# EasyEDA Pro project ProPrj_741_2025-12-09.epro

# Schematic 741_Schematic
Board Name: Board1; Create Date: 2025-11-30; Page Name: P1; Project Name: 741; Schematic Name: 741_Schematic; Update Date: 2025-12-01; Company: 嘉立创EDA; Page Size: A4; Version: V1.0
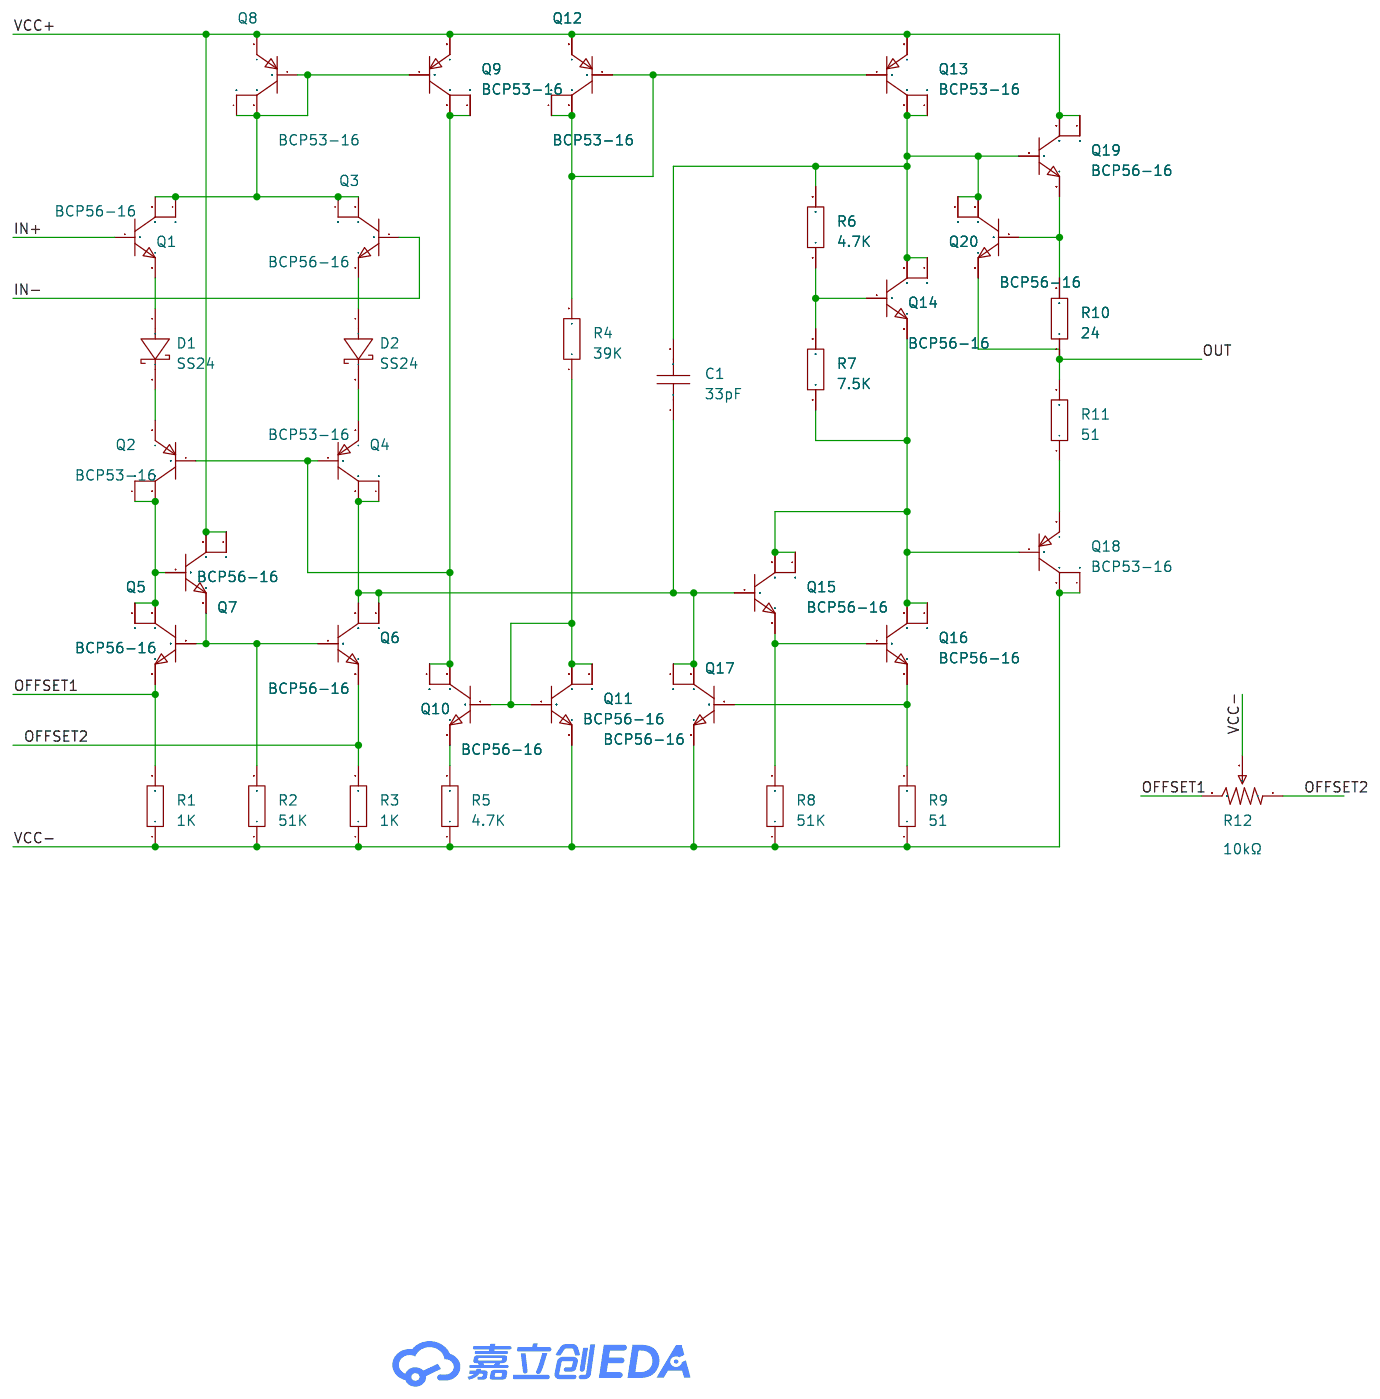
[diagram p0: schematic sheet]

## Parts
C1  33pF  [C0805]
D1  SS24  [SMA_L4.3-W2.6-LS5.0-FD]
D2  SS24  [SMA_L4.3-W2.6-LS5.0-FD]
Q1  BCP56-16  [SOT-223-4_L6.5-W3.5-P2.30-LS7.0-BR]
Q2  BCP53-16  [SOT-223-3_L6.7-W3.7-P2.30-LS7.0-BR]
Q3  BCP56-16  [SOT-223-4_L6.5-W3.5-P2.30-LS7.0-BR]
Q4  BCP53-16  [SOT-223-3_L6.7-W3.7-P2.30-LS7.0-BR]
Q5  BCP56-16  [SOT-223-4_L6.5-W3.5-P2.30-LS7.0-BR]
Q6  BCP56-16  [SOT-223-4_L6.5-W3.5-P2.30-LS7.0-BR]
Q7  BCP56-16  [SOT-223-4_L6.5-W3.5-P2.30-LS7.0-BR]
Q8  BCP53-16  [SOT-223-3_L6.7-W3.7-P2.30-LS7.0-BR]
Q9  BCP53-16  [SOT-223-3_L6.7-W3.7-P2.30-LS7.0-BR]
Q10  BCP56-16  [SOT-223-4_L6.5-W3.5-P2.30-LS7.0-BR]
Q11  BCP56-16  [SOT-223-4_L6.5-W3.5-P2.30-LS7.0-BR]
Q12  BCP53-16  [SOT-223-3_L6.7-W3.7-P2.30-LS7.0-BR]
Q13  BCP53-16  [SOT-223-3_L6.7-W3.7-P2.30-LS7.0-BR]
Q14  BCP56-16  [SOT-223-4_L6.5-W3.5-P2.30-LS7.0-BR]
Q15  BCP56-16  [SOT-223-4_L6.5-W3.5-P2.30-LS7.0-BR]
Q16  BCP56-16  [SOT-223-4_L6.5-W3.5-P2.30-LS7.0-BR]
Q17  BCP56-16  [SOT-223-4_L6.5-W3.5-P2.30-LS7.0-BR]
Q18  BCP53-16  [SOT-223-3_L6.7-W3.7-P2.30-LS7.0-BR]
Q19  BCP56-16  [SOT-223-4_L6.5-W3.5-P2.30-LS7.0-BR]
Q20  BCP56-16  [SOT-223-4_L6.5-W3.5-P2.30-LS7.0-BR]
R1  1K  [R0805]
R2  51K  [R0805]
R3  1K  [R0805]
R4  39K  [R0805]
R5  4.7K  [R0805]
R6  4.7K  [R0805]
R7  7.5K  [R0805]
R8  51K  [R0805]
R9  51  [R0805]
R10  24  [R0805]
R11  51  [R0805]
R12  10kΩ  [电位器]

## Library data of the parts
C1 = CAP_0805: Supplier Footprint: 0805
D1 D2 = SS24_C7420362: 二极管配置:独立式;正向压降(Vf):550mV@2A;直流反向耐压(Vr):40V;整流电流:2A;; LCSC Part Name: 电压:40V 电流:2A; Supplier Part: C7420362; Manufacturer: R+O(宏嘉诚); Supplier Footprint: SMA(DO-214AC); JLCPCB Part Class: 扩展库; Datasheet: https://item.szlcsc.com/datasheet/SS24/8397184.html; Supplier: LCSC; Diode Configuration: 独立式; Voltage - Forward(Vf@If): 550mV@2A; Voltage - DC Reverse(Vr): 40V; Current - Rectified: 2A; Reverse Leakage Current (Ir): 200uA@40V; Operating Junction Temperature Range: -55℃~+150℃; Non-Repetitive Peak Forward Surge Current: 50A
Q1 Q3 Q5-Q7 Q10 Q11 Q14-Q17 Q19 Q20 = BCP56-16_C41375109: 晶体管类型:NPN;集电极电流(Ic):1A;集射极击穿电压(Vceo):80V;耗散功率(Pd):1.33W;直流电流增益(hFE):25@5mA,2V;; LCSC Part Name: NPN 电流:1A 电压:80V; Supplier Part: C41375109; Manufacturer: R+O(宏嘉诚); Supplier Footprint: SOT-223; JLCPCB Part Class: 扩展库; Datasheet: https://item.szlcsc.com/datasheet/BCP56-16/43142109.html; Supplier: LCSC; type: NPN; Current - Collector(Ic): 1A; Collector - Emitter Voltage VCEO: 80V; Pd - Power Dissipation: 1.33W; DC Current Gain: 25@5mA,2V; Transition frequency(fT): 130MHz; Current - Collector Cutoff: 100nA; Vce Saturation(VCE(sat)): 500mV@500mA,50mA; Emitter-Base Voltage(Vebo): 5V
Q2 Q4 Q8 Q9 Q12 Q13 Q18 = BCP53-16_C41375110: 晶体管类型:PNP;集电极电流(Ic):1A;集射极击穿电压(Vceo):100V;耗散功率(Pd):1.5W;直流电流增益(hFE):250@150mA,3V;; LCSC Part Name: PNP 电流:1A 电压:100V; Supplier Part: C41375110; Manufacturer: R+O(宏嘉诚); Supplier Footprint: SOT-223; JLCPCB Part Class: 扩展库; Datasheet: https://item.szlcsc.com/datasheet/BCP53-16/43142110.html; Supplier: LCSC; type: PNP; Current - Collector(Ic): 1A; Collector - Emitter Voltage VCEO: 100V; Pd - Power Dissipation: 1.5W; DC Current Gain: 250@150mA,3V; Transition frequency(fT): 100MHz; Current - Collector Cutoff: 100nA; Vce Saturation(VCE(sat)): 500mV@500mA,50mA; Emitter-Base Voltage(Vebo): 5V
R1-R11 = Res_0805: Supplier Footprint: 0805
R12 = 3296W-1-103_C48997937: 阻值:10kΩ;精度:±10%;功率:500mW;温度系数:±250ppm/℃;; LCSC Part Name: 3296W-1-103; Supplier Part: C48997937; Manufacturer: JIERR(捷而瑞); Manufacturer Part: 3296W-1-103; Supplier Footprint: 插件-3P,9.5x4.9mm; JLCPCB Part Class: 扩展库; Datasheet: https://item.szlcsc.com/datasheet/3296W-1-103/51342073.html; Supplier: LCSC; Tolerance: ±10%; Power(Watts): 500mW; Temperature Coefficient: ±250ppm/℃; Number of Turns: 28

## Nets
VCC+: Q7.2(C) Q7.4(C) Q8.3(E) Q9.3(E) Q12.3(E) Q13.3(E) Q19.2(C) Q19.4(C)
VCC-: Q11.3(E) Q17.3(E) Q18.2(C) Q18.4(C) R1.1 R2.1 R3.1 R5.1 R8.1 R9.1 R12.2
IN+: Q1.1(B)
IN-: Q3.1(B)
OFFSET1: Q5.3(E) R1.2 R12.3
OFFSET2: Q6.3(E) R3.2 R12.1
OUT: Q20.3(E) R10.1 R11.2
$1N519: Q1.2(C) Q1.4(C) Q3.2(C) Q3.4(C) Q8.1(B) Q8.2(C) Q8.4(C) Q9.1(B)
$1N1834: D1.1(A) Q1.3(E)
$1N1839: D1.2(K) Q2.3(E)
$1N1844: Q2.2(C) Q2.4(C) Q5.2(C) Q5.4(C) Q7.1(B)
$1N1895: C1.1 Q4.2(C) Q4.4(C) Q6.2(C) Q6.4(C) Q15.1(B) Q17.2(C) Q17.4(C)
$1N1914: D2.2(K) Q4.3(E)
$1N1919: D2.1(A) Q3.3(E)
$1N2205: Q10.3(E) R5.2
$1N2269: Q12.1(B) Q12.2(C) Q12.4(C) Q13.1(B) R4.2
$1N2407: Q10.1(B) Q11.1(B) Q11.2(C) Q11.4(C) R4.1
$1N2487: Q15.3(E) Q16.1(B) R8.2
$1N2501: Q16.3(E) Q17.1(B) R9.2
$1N2520: Q14.3(E) Q15.2(C) Q15.4(C) Q16.2(C) Q16.4(C) Q18.1(B) R7.1
$1N2546: C1.2 Q13.2(C) Q13.4(C) Q14.2(C) Q14.4(C) Q19.1(B) Q20.2(C) Q20.4(C) R6.2
$1N2565: Q14.1(B) R6.1 R7.2
$1N2679: Q19.3(E) Q20.1(B) R10.2
$1N2714: Q18.3(E) R11.1
$1N3714: Q2.1(B) Q4.1(B) Q9.2(C) Q9.4(C) Q10.2(C) Q10.4(C)
$1N3732: Q5.1(B) Q6.1(B) Q7.3(E) R2.2

# Board 741_PCB
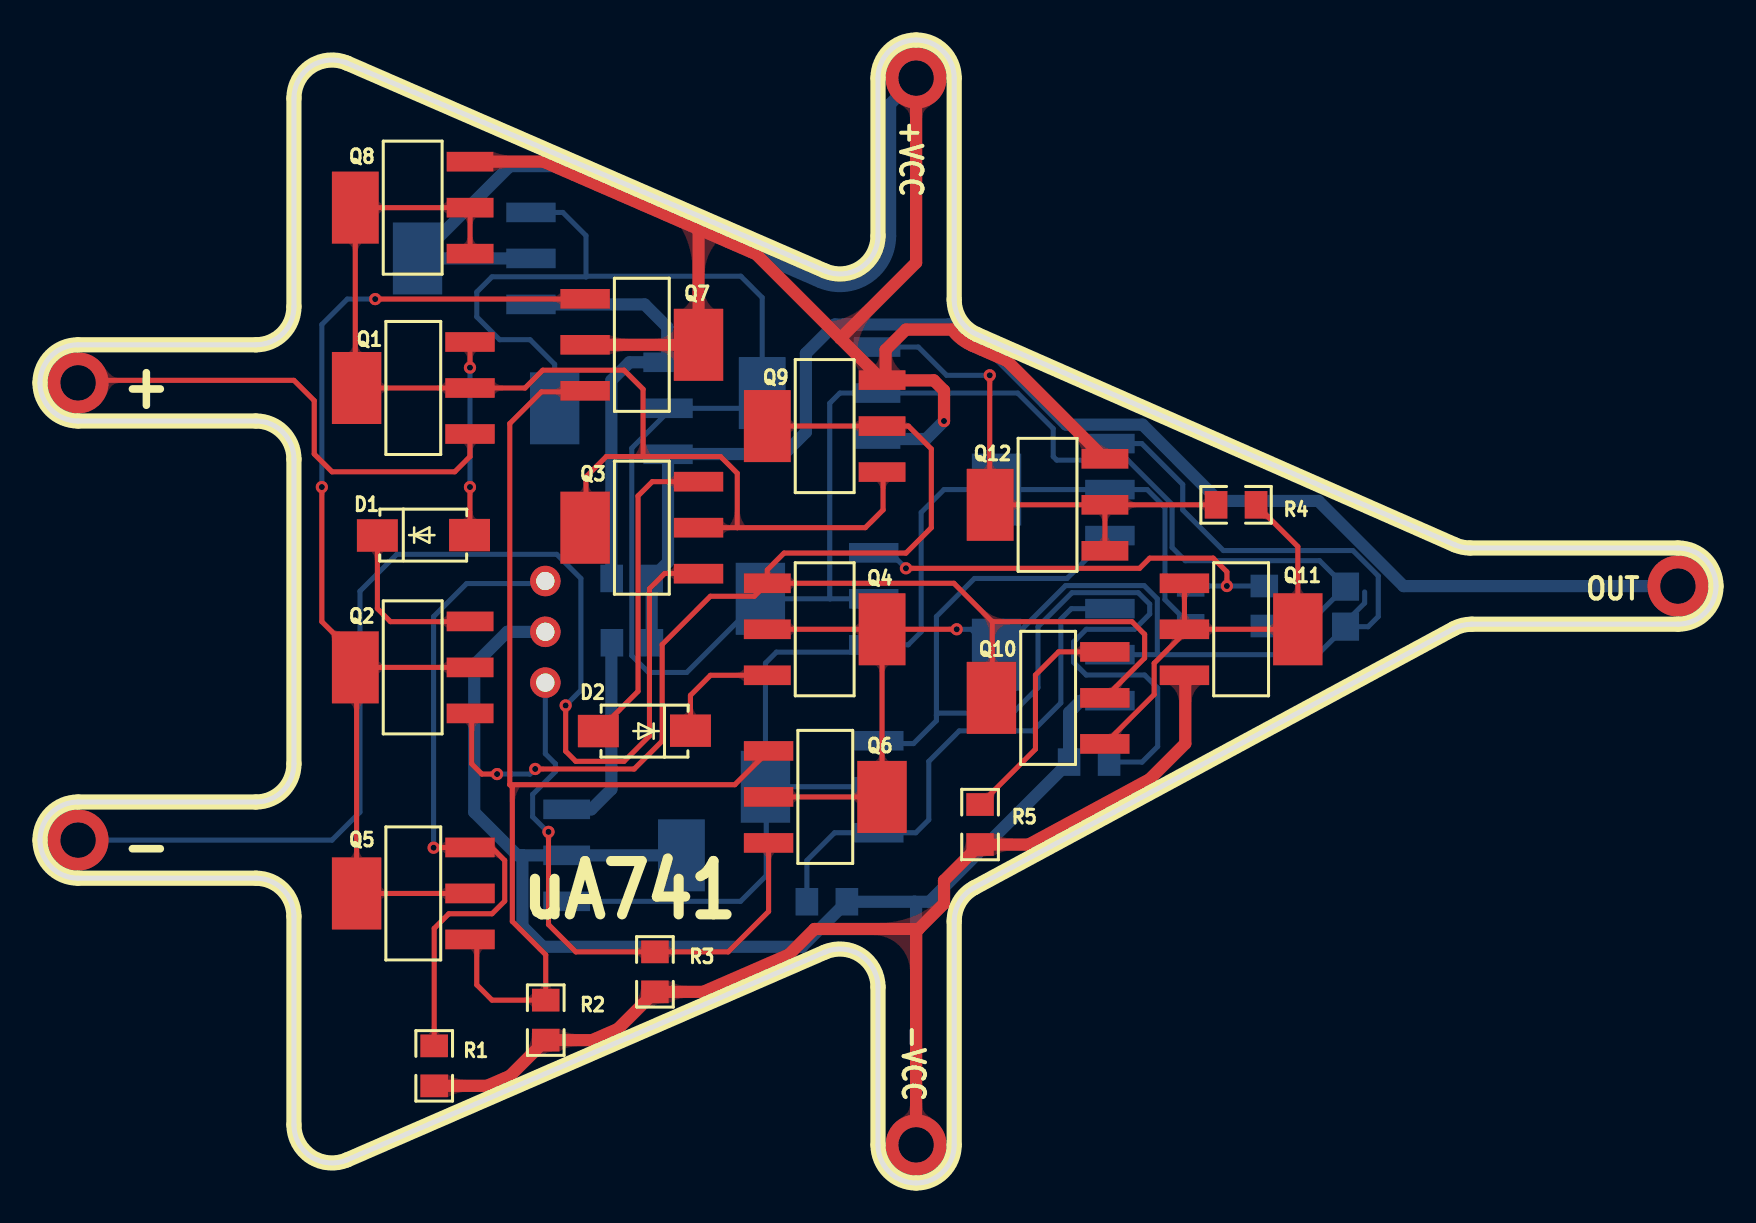
[diagram p1: board, top side]
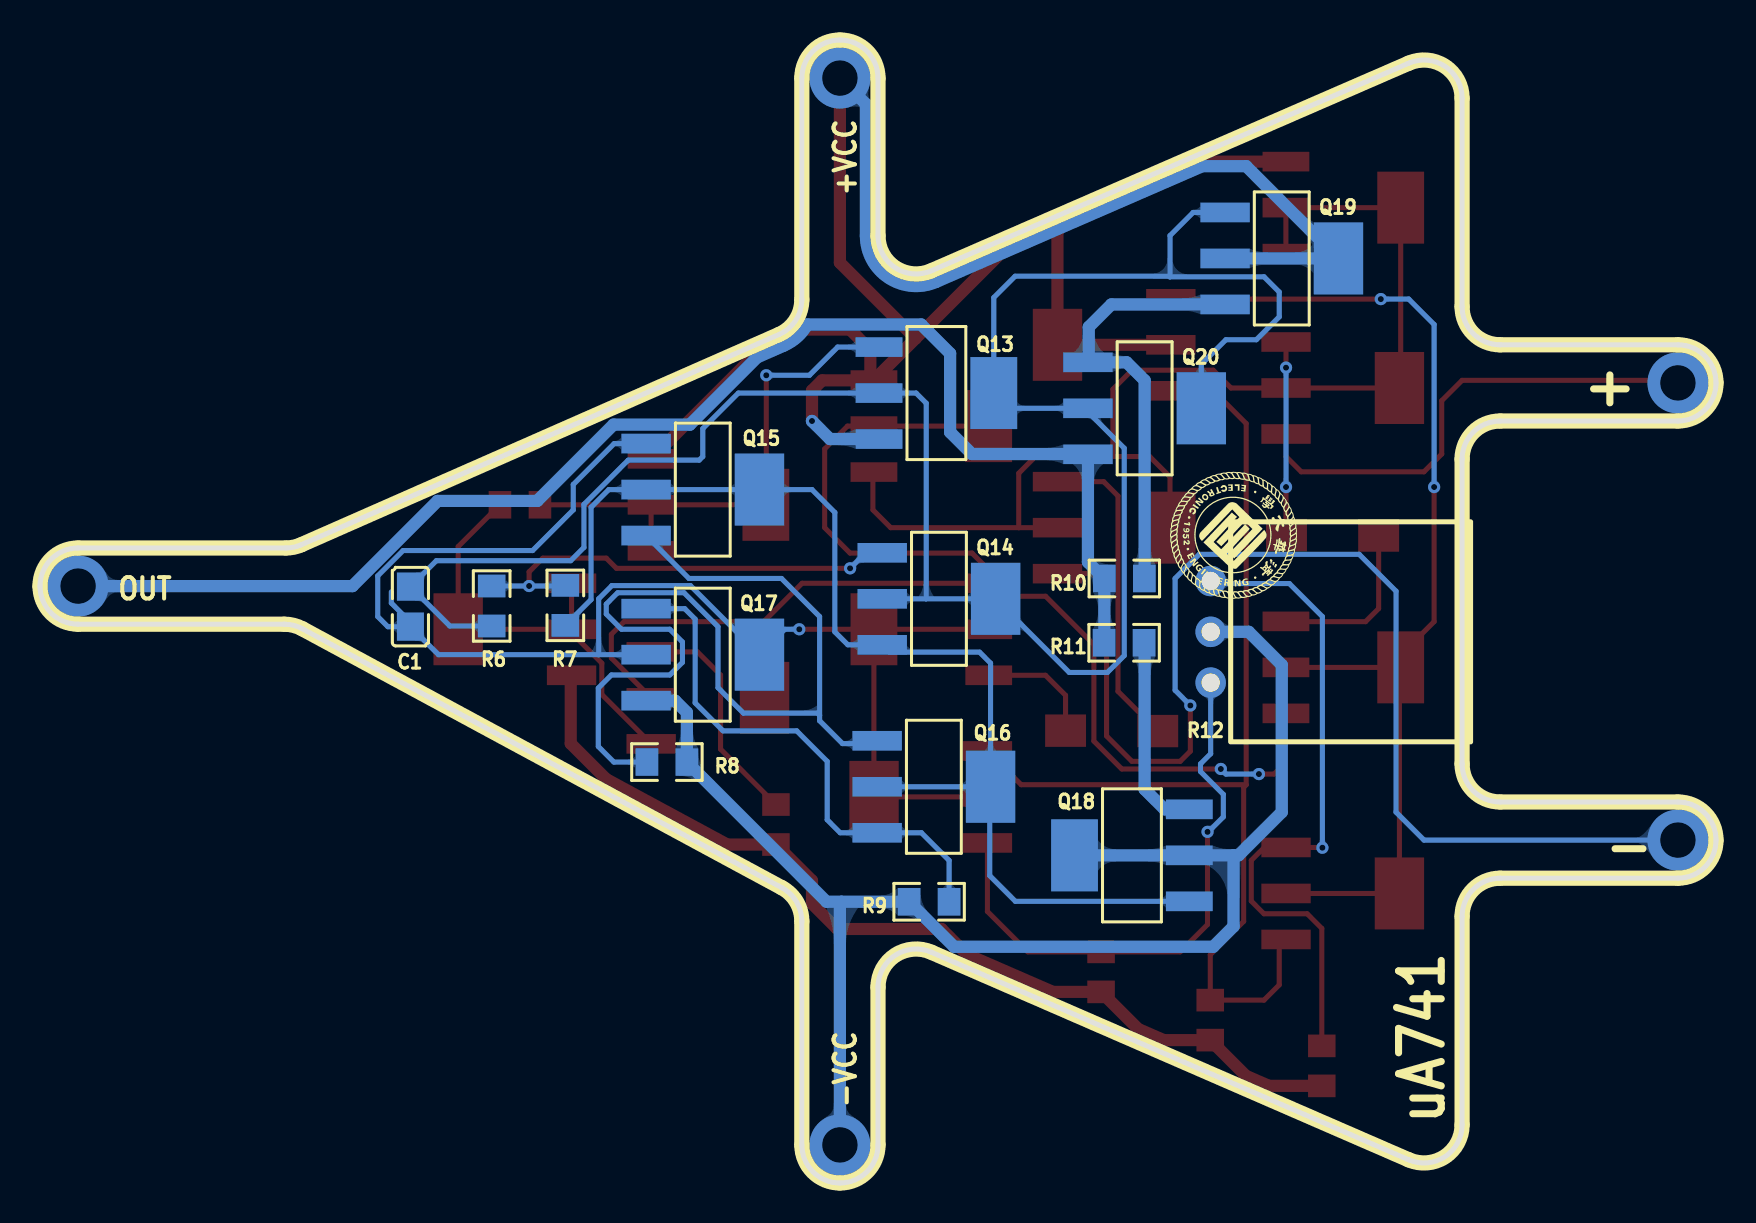
[diagram p2: board, bottom side, seen from below]

Outline 83.82 x 57.15 mm; copper layers: Top Layer, Bottom Layer. Coordinates in mm from the lower left corner of the outline.
Outline path: 0,40.01 arc(0.56,41.35) 1.91,41.91 10.8,41.91 arc(12.14,42.47) 12.7,43.82 12.7,54.24 arc(13.56,55.84) 15.36,55.99 39.25,45.61 arc(41.05,45.76) 41.91,47.36 41.91,55.25 arc(42.47,56.59) 43.81,57.15 arc(45.16,56.59) 45.72,55.25 45.72,44.17 arc(46.03,43.13) 46.86,42.43 70.75,31.91 arc(71.13,31.79) 71.52,31.75 81.91,31.75 arc(83.26,31.19) 83.82,29.84 arc(83.26,28.5) 81.91,27.94 71.6,27.94 arc(71.13,27.88) 70.7,27.71 46.72,14.76 arc(45.99,14.06) 45.72,13.09 45.72,1.91 arc(45.16,0.56) 43.81,0 arc(42.47,0.56) 41.91,1.91 41.91,9.79 arc(41.05,11.39) 39.25,11.54 15.36,1.16 arc(13.56,1.31) 12.7,2.91 12.7,13.34 arc(12.14,14.68) 10.8,15.24 1.91,15.24 arc(0.56,15.8) 0,17.15 arc(0.56,18.49) 1.91,19.05 10.8,19.05 arc(12.14,19.61) 12.7,20.96 12.7,36.2 arc(12.14,37.54) 10.8,38.1 1.91,38.1 arc(0.56,38.66) 0,40.01
Stack: Top Layer 0.035mm / Dielectric1 1.51mm FR4 er 4.5 / Bottom Layer 0.035mm

## Design rules (mm)
template: JLCPCB Capability(Two Layers Board)
spacing copperThickness1oz (default): track to track 0.102, other pairs 0.152 to 0.3
spacing copperThickness2oz: track to track 0.203, other pairs 0.152 to 0.3
track width copperThickness1oz (default): min 0.127, default 0.254, max 2.54
track width copperThickness2oz: min 0.203, default 0.254, max 2.54
differential pair differentialPair (default): width min 0.127, default 0.254, max 2.54; gap min 0.152, default 0.152
via viaSize (default): diameter min 0.5, default 0.61, max 10; hole min 0.3, default 0.305, max 6.3

## Placement (name value [footprint] x y rotation side)
C1  33pF  [C0805]  65.29 28.82 90 bottom
D1  SS24  [SMA_L4.3-W2.6-LS5.0-FD]  19.18 32.39 180 top
D2  SS24  [SMA_L4.3-W2.6-LS5.0-FD]  30.23 22.61 0 top
Q1  BCP56-16  [SOT-223-4_L6.5-W3.5-P2.30-LS7.0-BR]  18.67 39.75 0 top
Q2  BCP53-16  [SOT-223-3_L6.7-W3.7-P2.30-LS7.0-BR]  18.64 25.78 0 top
Q3  BCP56-16  [SOT-223-4_L6.5-W3.5-P2.30-LS7.0-BR]  30.1 32.77 0 top
Q4  BCP53-16  [SOT-223-3_L6.7-W3.7-P2.30-LS7.0-BR]  39.24 27.69 180 top
Q5  BCP56-16  [SOT-223-4_L6.5-W3.5-P2.30-LS7.0-BR]  18.67 14.48 0 top
Q6  BCP56-16  [SOT-223-4_L6.5-W3.5-P2.30-LS7.0-BR]  39.27 19.3 180 top
Q7  BCP56-16  [SOT-223-4_L6.5-W3.5-P2.30-LS7.0-BR]  30.1 41.91 180 top
Q8  BCP53-16  [SOT-223-3_L6.7-W3.7-P2.30-LS7.0-BR]  18.64 48.77 0 top
Q9  BCP53-16  [SOT-223-3_L6.7-W3.7-P2.30-LS7.0-BR]  39.24 37.85 0 top
Q10  BCP56-16  [SOT-223-4_L6.5-W3.5-P2.30-LS7.0-BR]  50.42 24.26 0 top
Q11  BCP56-16  [SOT-223-4_L6.5-W3.5-P2.30-LS7.0-BR]  60.07 27.69 180 top
Q12  BCP53-16  [SOT-223-3_L6.7-W3.7-P2.30-LS7.0-BR]  50.39 33.91 0 top
Q13  BCP53-16  [SOT-223-3_L6.7-W3.7-P2.30-LS7.0-BR]  38.99 39.5 0 bottom
Q14  BCP56-16  [SOT-223-4_L6.5-W3.5-P2.30-LS7.0-BR]  38.86 29.21 0 bottom
Q15  BCP56-16  [SOT-223-4_L6.5-W3.5-P2.30-LS7.0-BR]  50.67 34.67 0 bottom
Q16  BCP56-16  [SOT-223-4_L6.5-W3.5-P2.30-LS7.0-BR]  39.12 19.81 0 bottom
Q17  BCP56-16  [SOT-223-4_L6.5-W3.5-P2.30-LS7.0-BR]  50.67 26.42 0 bottom
Q18  BCP53-16  [SOT-223-3_L6.7-W3.7-P2.30-LS7.0-BR]  29.21 16.38 180 bottom
Q19  BCP56-16  [SOT-223-4_L6.5-W3.5-P2.30-LS7.0-BR]  21.72 46.23 0 bottom
Q20  BCP56-16  [SOT-223-4_L6.5-W3.5-P2.30-LS7.0-BR]  28.57 38.73 0 bottom
R1  1K  [R0805]  19.72 5.86 90 top
R2  51K  [R0805]  25.29 8.14 90 top
R3  1K  [R0805]  30.75 10.56 90 top
R4  39K  [R0805]  59.82 33.91 180 top
R5  4.7K  [R0805]  47.01 17.92 90 top
R6  4.7K  [R0805]  61.23 28.85 270 bottom
R7  7.5K  [R0805]  57.55 28.88 90 bottom
R8  51K  [R0805]  52.47 21.05 0 bottom
R9  51  [R0805]  39.35 14.06 180 bottom
R10  24  [R0805]  29.59 30.23 180 bottom
R11  51  [R0805]  29.6 27.01 0 bottom
R12  10kΩ  [电位器]  25.27 25.02 90 bottom

## Footprints (pads in the part's own frame, mm; a bottom-side part is the same pattern mirrored in y, then rotated)
C0805
  rect 1.41x1.35 smd: 1(-1,0) 2(1,0)
R0805
  rect 1.133x1.377 smd: 1(-1,0) 2(1,0)
SMA_L4.3-W2.6-LS5.0-FD
  rect 2.046x1.62 smd: 1(-2.304,-0.009) 2(2.304,0.009)
SOT-223-3_L6.7-W3.7-P2.30-LS7.0-BR
  rect 2.34x0.98 smd: 1(2.87,-2.3) 2(2.87,0) 3(2.87,2.3)
  rect 2.34x3.6 smd: 4(-2.87,0)
SOT-223-4_L6.5-W3.5-P2.30-LS7.0-BR
  rect 2.47x0.98 smd: 1(2.835,-2.3) 2(2.835,0) 3(2.835,2.3)
  rect 2.47x3.6 smd: 4(-2.835,0)
电位器
  round 1.524 hole 0.914: 1(0,0) 2(2.54,0) 3(5.08,0)

## Nets
As in the schematic.

## Via types
v1: diameter 3.048, hole 1.778, Top Layer to Bottom Layer, 5 vias
v2: diameter 0.61, hole 0.305, Top Layer to Bottom Layer, 14 vias

## Routing (per net, layer and track width the routed paths; a pad name or vN(x,y) marks a point on that pad's centre or on a via; arc(x,y) is an arc through that point)
VCC+: length 116.5
  Top Layer w0.61: 40.03,42.23 35.82,46.44 33.01,47.66 ; 40.03,42.23 43.81,46.02 v1(43.81,55.25) ; 40.03,42.23 Q9.3 ; v2(45.21,38.1) 45.21,39.62 44.7,40.13 42.13,40.13 Q9.3 ; Q7.2 Q7.4 32.93,47.58 33.01,47.66 ; Q8.3 25.17,51.07 33.01,47.66 ; Q9.3 42.29,40.32 42.29,41.66 43.31,42.67 45.61,42.67 arc(46.06,42.21) 46.61,41.87 48.37,41.1 Q12.3
  Bottom Layer w0.61: v2(45.21,38.1) 44.31,37.2 Q13.3 ; Q19.2 Q19.4 23.5,50.84 25.69,50.84 39,45.05 arc(41.38,45.26) 42.51,47.36 42.51,53.95 v1(43.81,55.25)
VCC-: length 133.4
  Top Layer w0.61: 43.94,12.7 38.74,12.7 37.46,11.42 33.16,9.56 R3.1 28.9,7.7 27.61,7.14 R2.1 23.51,5.36 22.36,4.86 R1.1 ; 43.94,12.7 43.81,12.57 v1(43.81,1.91) ; 43.94,12.7 45.21,13.97 45.21,15.12 R5.1 49.44,16.92 55.5,20.19 57.28,21.97 57.28,25.34 Q11.3
  Bottom Layer w0.61: Q18.4 Q18.2 24.13,16.38 ; 24.13,16.38 23.88,16.38 21.72,18.54 21.72,25.91 23.37,27.56 R12.2 ; 24.13,16.38 24.13,16.38 24.13,12.83 25.15,11.81 38.1,11.81 R9.1 43.74,14.06 ; Q17.3 52.06,24.12 51.47,23.53 R8.1 44.48,14.06 43.74,14.06 ; v1(43.81,1.91) 43.81,13.98 43.74,14.06
IN+: length 24.6
  Top Layer w0.254: Q1.1 21.5,36.32 20.74,35.56 14.61,35.56 13.72,36.45 13.72,39.12 12.7,40.13 2.03,40.13 v1(1.91,40.01)
IN-: length 62.1
  Top Layer w0.254: Q3.1 32.92,30.48 31.24,30.48 30.48,29.72 30.48,22.35 29.21,21.08 26.8,21.08 26.29,21.59 v2(26.29,23.88)
  Bottom Layer w0.254: v1(1.91,17.15) 14.61,17.15 16,18.54 16,29.59 17.84,31.43 25.84,31.43 27.05,30.23 27.05,24.64 v2(26.29,23.88)
OFFSET1: length 33.7
  Top Layer w0.254: v2(19.69,16.76) 19.7,16.78 Q5.3 22.59,16.78 23.24,16.13 23.24,14.1 22.61,13.46 20.45,13.46 19.72,12.73 R1.2
  Bottom Layer w0.254: v2(19.69,16.76) 19.69,28.32 21.34,29.97 25.15,29.97 R12.3
OFFSET2: length 29
  Top Layer w0.254: R3.2 26.8,11.56 25.43,12.92 v2(25.43,17.56) ; 30.75,11.56 34.42,11.56 36.44,13.58 Q6.3
  Bottom Layer w0.254: R12.1 25.27,21.46 25.78,20.96 25.78,20.57 24.64,19.43 24.64,18.31 25.39,17.56 v2(25.43,17.56)
OUT: length 70.6
  Bottom Layer w0.61: v1(81.91,29.84) 68.19,29.84 63.93,34.1 58.95,34.1 55.14,37.92 51.32,37.92 47.95,41.28 46.61,41.87 arc(45.94,42.31) 45.44,42.93 39.75,42.93 38.3,41.48 38.3,37.54 37.21,36.45 31.42,36.45 Q20.3 31.41,31.05 R10.1 30.59,27.02 R11.2
$1N519: length 60.7
  Top Layer w0.254: Q3.4 27.31,32.81 27.31,35.31 28.32,36.32 30.22,36.32 ; 30.22,36.32 30.16,36.38 30.16,39.69 29.21,40.64 25.15,40.64 24.26,39.75 Q1.2 Q1.4 15.77,39.82 Q8.4 Q8.2 Q8.1 ; 30.22,36.32 34.04,36.32 34.87,35.49 34.87,32.77 ; Q9.1 42.16,35.5 42.16,33.66 41.28,32.77 34.87,32.77 ; Q3.2 34.87,32.77
$1N1834: length 9.7
  Top Layer w0.254: D1.1 21.5,32.42 v2(21.5,34.8) ; Q1.3 v2(21.5,40.77)
  Bottom Layer w0.254: v2(21.5,40.77) v2(21.5,34.8)
$1N1839: length 8.6
  Top Layer w0.254: D1.2 16.87,28.72 17.53,28.07 21.5,28.07 Q2.3
$1N1844: length 54.3
  Top Layer w0.254: v2(14.1,34.8) 14.1,28.07 15.77,26.4 Q2.4 ; Q2.4 Q2.2 ; Q2.4 15.83,25.72 Q5.4 Q5.2 ; v2(16.76,44.2) 27.25,44.2 Q7.1
  Bottom Layer w0.254: v2(16.76,44.2) 15.37,44.2 14.1,42.93 v2(14.1,34.8)
$1N1895: length 73.9
  Top Layer w0.254: Q4.4 Q4.2 ; Q4.4 v2(45.85,27.69) ; Q4.4 42.11,19.31 Q6.4 Q6.2
  Bottom Layer w0.254: C1.1 63.89,26.42 55.88,26.42 ; C1.1 65.3,27.81 66.42,27.81 66.93,28.32 66.93,30.35 65.66,31.62 59.18,31.62 57.15,33.66 57.15,34.93 55.1,36.97 Q15.1 ; C1.1 65.29,28.04 66.25,29 66.25,29.55 ; 55.88,26.42 Q17.2 ; 55.88,26.42 55.88,29.21 55.22,29.87 51.29,29.87 Q17.4 46.57,27.69 v2(45.85,27.69)
$1N1914: length 6
  Top Layer w0.254: Q4.3 33.53,25.39 32.53,24.38 D2.2
$1N1919: length 15.9
  Top Layer w0.254: Q3.3 30.62,35.07 29.91,34.35 29.91,24.58 D2.1
$1N2205: length 11.6
  Top Layer w0.254: Q10.3 50.94,26.56 49.78,25.4 49.78,21.69 R5.2
$1N2269: length 26.5
  Top Layer w0.254: Q12.2 Q12.4 47.5,33.93 v2(47.5,40.39) ; Q12.2 58.44,33.91 58.82,33.53 ; Q12.2 Q12.1
  Bottom Layer w0.254: 41.86,41.8 43.93,41.8 45.34,40.39 v2(47.5,40.39)
$1N2407: length 22.4
  Top Layer w0.254: Q11.2 57.24,27.51 55.72,25.99 55.72,24.43 Q10.1 ; Q11.2 Q11.1 ; Q11.2 Q11.4 62.91,31.82 R4.1
$1N2487: length 50.5
  Bottom Layer w0.254: Q16.1 42.09,21.97 43.69,21.97 44.83,23.11 44.83,23.39 ; 44.83,23.39 44.83,28.32 46.74,30.23 51.36,30.23 Q15.3 ; 44.83,23.39 44.94,23.5 48.64,23.5 49.91,24.77 49.91,27.81 51.61,29.51 54.93,29.51 55.5,28.94 55.5,28.45 54.74,27.69 52.32,27.69 51.69,27.05 51.69,26.04 52.32,25.4 55.25,25.4 55.9,24.75 55.9,21.83 55.12,21.05 R8.2
$1N2501: length 26.6
  Bottom Layer w0.254: R9.2 38.35,16.13 39.74,17.51 Q16.3 43.8,17.51 44.45,18.16 44.45,21.08 45.97,22.61 49.66,22.61 51.05,24 51.05,28.19 51.58,28.72 Q17.1
$1N2520: length 60.7
  Bottom Layer w0.254: Q16.4 Q16.2 ; Q16.4 36.28,25.99 36.83,26.54 41.33,26.54 Q14.3 43.42,26.91 44.07,27.56 44.07,33.53 45.21,34.67 Q15.4 Q15.2 55.37,34.67 56.26,33.78 56.26,29.17 R7.1 ; Q16.4 36.32,19.77 36.32,15.37 35.04,14.08 Q18.1
$1N2546: length 112.3
  Bottom Layer w0.254: 27.31,45.31 22.61,45.31 21.84,44.55 21.84,43.31 22.99,42.16 24.51,42.16 25.74,40.94 Q20.4 ; 27.31,45.31 27.31,47.37 26.15,48.53 Q19.1 ; 27.31,45.31 27.33,45.31 27.36,45.34 35.05,45.34 36.12,44.27 Q13.4 35.36,38.73 Q20.2 31.41,38.55 29.59,36.74 29.59,26.37 30.44,25.53 32.34,25.53 Q14.4 39.51,29.21 ; 39.51,29.21 39.5,29.22 39.5,38.99 40,39.5 Q13.2 48.9,39.5 50.67,37.72 50.67,36.32 50.85,36.14 54.4,36.14 56.62,33.93 56.62,31.78 57.28,31.12 64,31.12 C1.2 63.33,27.85 R6.2 ; 39.51,29.21 Q14.2
$1N2565: length 22.9
  Top Layer w0.254: v2(43.31,30.73) 54.99,30.73 55.5,31.24 58.67,31.24 59.36,30.56 v2(59.36,29.85)
  Bottom Layer w0.254: R7.2 57.58,29.85 v2(59.36,29.85) R6.1 ; v2(43.31,30.73) 42.53,31.51 Q14.1
$1N2679: length 22.2
  Bottom Layer w0.61: Q19.3 30.24,43.93 31.37,42.8 31.37,41.08 Q20.1 29.48,41.04 28.57,40.13 28.57,30.24 R10.2
$1N2714: length 10
  Bottom Layer w0.61: R11.1 28.57,26.98 28.57,19.69 27.57,18.68 Q18.3
$1N3714: length 74.5
  Top Layer w0.254: Q10.2 55.25,26.25 55.25,27.43 54.61,28.07 47.62,28.07 ; Q4.1 36.37,30.66 37.21,31.5 43.31,31.5 44.58,32.77 44.58,36.7 43.43,37.85 Q9.2 Q9.4 ; Q4.1 35.72,29.34 33.53,29.34 31.12,26.92 31.12,22.1 29.72,20.7 v2(24.76,20.7) ; Q4.1 45.71,29.99 47.62,28.07 ; Q10.4 47.62,24.3 47.62,28.07 ; Q2.1 21.59,23.4 21.59,20.96 22.1,20.45 v2(22.86,20.45)
  Bottom Layer w0.254: v2(22.86,20.45) 24.51,20.45 v2(24.76,20.7)
$1N3732: length 53.8
  Top Layer w0.254: 23.5,19.92 34.75,19.92 Q6.1 ; 23.5,19.92 23.62,19.79 23.62,13.08 25.29,11.41 R2.2 22.61,9.14 21.84,9.91 21.84,11.84 Q5.1 ; 23.5,19.92 23.5,37.97 25.08,39.56 27.21,39.56 Q7.3

Small or netless copper shapes (teardrops, artwork), in the pictures only: 110 on Top Layer, 91 on Bottom Layer

## Text on the board
Bottom Silkscreen Layer: +VCC | -VCC | OUT | + | - | uA741
Top Silkscreen Layer: OUT | +VCC | -VCC | - | + | uA741
